# EAGLE design Speed (EAGLE 6.5.0)

## Sheet 1 of 2
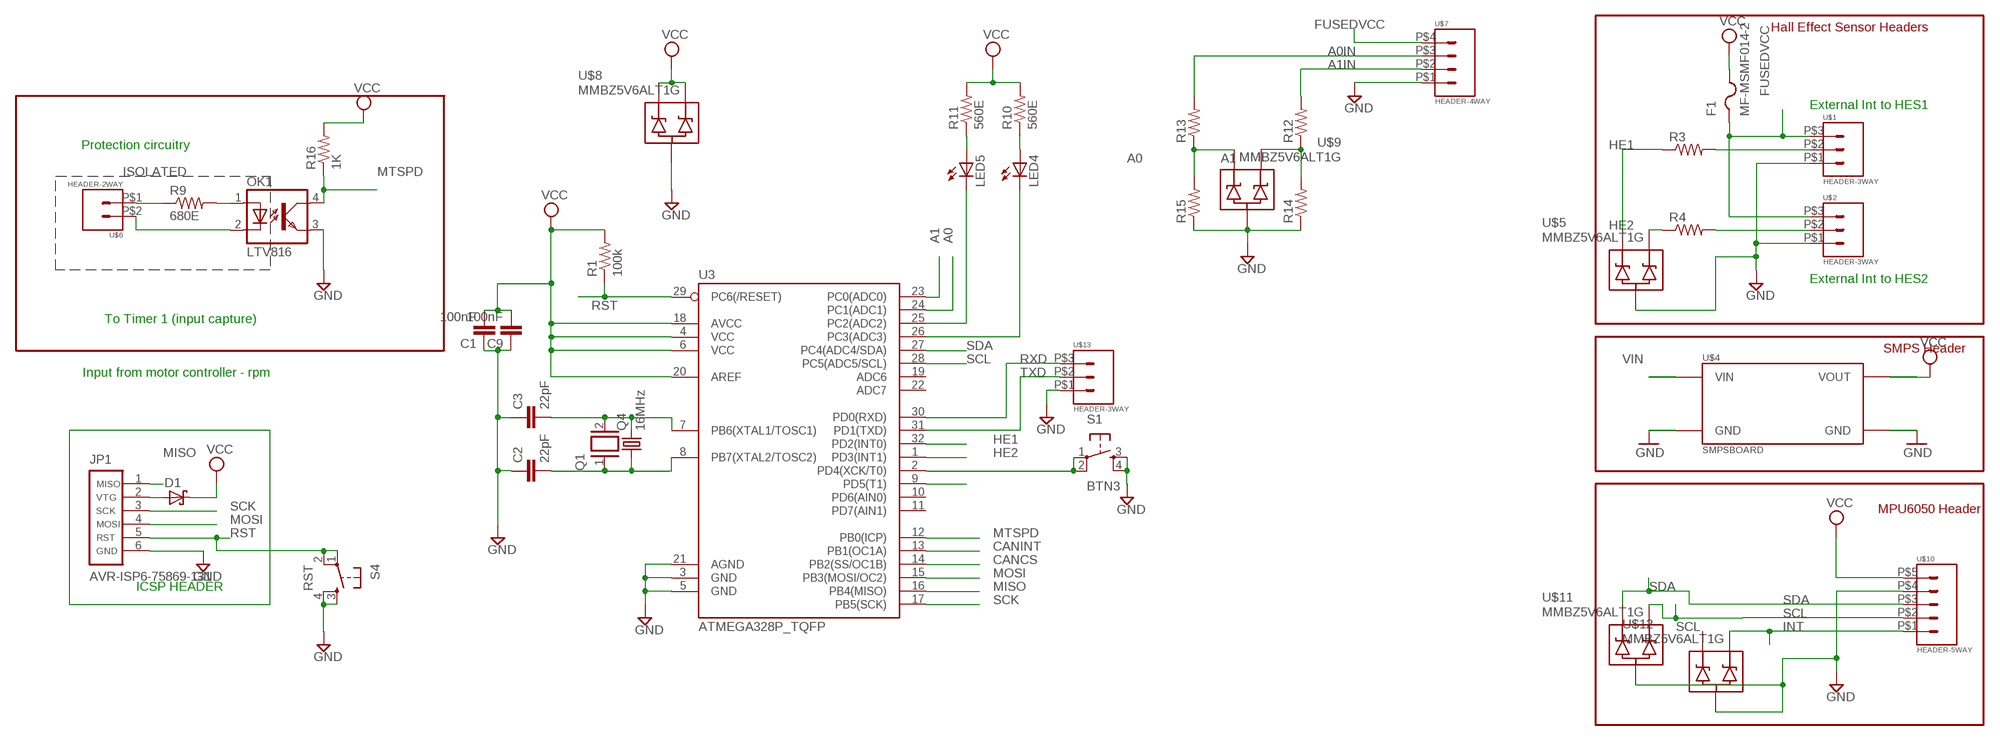
[diagram p0: schematic, sheet 1]

### Parts
C1  100nF  C-EUC0805  [C0805]
C2  22pF  C-EUC0805  [C0805]
C3  22pF  C-EUC0805  [C0805]
C9  100nF  C-EUC0805  [C0805]
D1  SCHOTTKY-DIODESMD  [SMB]
F1  MF-MSMF014-2  PTCFUSE-1812  [1812]
JP1  AVR-ISP6-75869-131  [HDR-75869-131]
LED4  LEDCHIP-LED0805  [CHIP-LED0805]
LED5  LEDCHIP-LED0805  [CHIP-LED0805]
OK1  LTV816  [DIL04]
Q1  XTAL/S  [QS]
Q4  16MHz  CRYSTALHC49UP  [HC49UP]
R1  100k  R-US_M0805  [M0805]
R3  R-US_M0805  [M0805]
R4  R-US_M0805  [M0805]
R9  680E  R-US_M0805  [M0805]
R10  560E  R-US_M0805  [M0805]
R11  560E  R-US_M0805  [M0805]
R12  R-US_M0805  [M0805]
R13  R-US_M0805  [M0805]
R14  R-US_M0805  [M0805]
R15  R-US_M0805  [M0805]
R16  1K  R-US_M0805  [M0805]
S1  BTN3  TAC_SWITCHSMD  [TACTILE_SWITCH_SMD]
S4  RST  TAC_SWITCHSMD  [TACTILE_SWITCH_SMD]
U3  ATMEGA328P_TQFP  [TQFP32-08]
U$1  HEADER-3WAY  [1744426-3]
U$2  HEADER-3WAY  [1744426-3]
U$4  SMPSBOARD  [SMPSBOARD]
U$5  MMBZ5V6ALT1G  [SOT23]
U$6  HEADER-2WAY  [1744426-2]
U$7  HEADER-4WAY  [1744426-4]
U$8  MMBZ5V6ALT1G  [SOT23]
U$9  MMBZ5V6ALT1G  [SOT23]
U$10  HEADER-5WAY  [1744426-5]
U$11  MMBZ5V6ALT1G  [SOT23]
U$12  MMBZ5V6ALT1G  [SOT23]
U$13  HEADER-3WAY  [1744426-3]

### Nets
A0: R12.1 R14.2 U3.24(PC1(ADC1)) U$9.2(A2)
A0IN: R13.2 U$7.P$3
A1: R13.1 R15.2 U3.23(PC0(ADC0)) U$9.1(A1)
A1IN: R12.2 U$7.P$2
CANCS: U3.14(PB2(SS/OC1B)) ; also sheet 2
CANINT: U3.13(PB1(OC1A)) ; also sheet 2
FUSEDVCC: F1.1 U$1.P$3 U$2.P$3 U$7.P$4
GND: C1.1 C2.1 C3.1 C9.1 JP1.6 OK1.3(EMIT) R14.1 R15.1 S1.3 S1.4 S4.3 S4.4 U3.3(GND) U3.5(GND) U3.21(AGND) U$1.P$1 U$2.P$1 U$4.GND U$4.GND@(GND) U$5.3(C) U$7.P$1 U$8.3(C) U$9.3(C) U$10.P$4 U$11.3(C) U$12.3(C) U$13.P$1 ; also sheet 2
HE1: R3.1 U3.32(PD2(INT0)) U$5.2(A2)
HE2: R4.1 U3.1(PD3(INT1)) U$5.1(A1)
INT: U3.9(PD5(T1)) U$10.P$1 U$12.1(A1)
MISO: JP1.1 U3.16(PB4(MISO)) ; also sheet 2
MOSI: JP1.4 U3.15(PB3(MOSI/OC2)) ; also sheet 2
MTSPD: OK1.4(COL) R16.1 U3.12(PB0(ICP))
N$2: D1.A JP1.2
N$3: R9.1 U$6.P$1
N$4: OK1.1(A) R9.2
N$5: C3.2 Q1.2 Q4.2 U3.7(PB6(XTAL1/TOSC1))
N$6: C2.2 Q1.1 Q4.1 U3.8(PB7(XTAL2/TOSC2))
N$7: LED4.A R10.1
N$8: LED5.A R11.1
N$9: LED5.C U3.25(PC2(ADC2))
N$10: LED4.C U3.26(PC3(ADC3))
N$11: S1.1 S1.2 U3.2(PD4(XCK/T0))
N$12: OK1.2(C) U$6.P$2
PD2: R3.2 U$1.P$2
PD3: R4.2 U$2.P$2
RST: JP1.5 R1.1 S4.1 S4.2 U3.29(PC6(/RESET))
RXD: U3.30(PD0(RXD)) U$13.P$3
SCK: JP1.3 U3.17(PB5(SCK)) ; also sheet 2
SCL: U3.28(PC5(ADC5/SCL)) U$10.P$2 U$11.1(A1)
SDA: U3.27(PC4(ADC4/SDA)) U$10.P$3 U$11.2(A2)
TXD: U3.31(PD1(TXD)) U$13.P$2
VCC: C1.2 C9.2 D1.C F1.2 R1.2 R10.2 R11.2 R16.2 U3.4(VCC) U3.6(VCC) U3.18(AVCC) U3.20(AREF) U$4.VOUT U$8.1(A1) U$8.2(A2) U$10.P$5 ; also sheet 2
VIN: U$4.VIN ; also sheet 2
Unconnected: U3.10(PD6(AIN0)) U3.11(PD7(AIN1)) U3.19(ADC6) U3.22(ADC7) U$12.2(A2)

### Notes on the sheet
- Hall Effect Sensor Headers
- External Int to HES1
- Protection circuitry
- ISOLATED
- External Int to HES2
- To Timer 1 (input capture)
- SMPS Header
- Input from motor controller - rpm
- MPU6050 Header
- ICSP HEADER

## Sheet 2 of 2
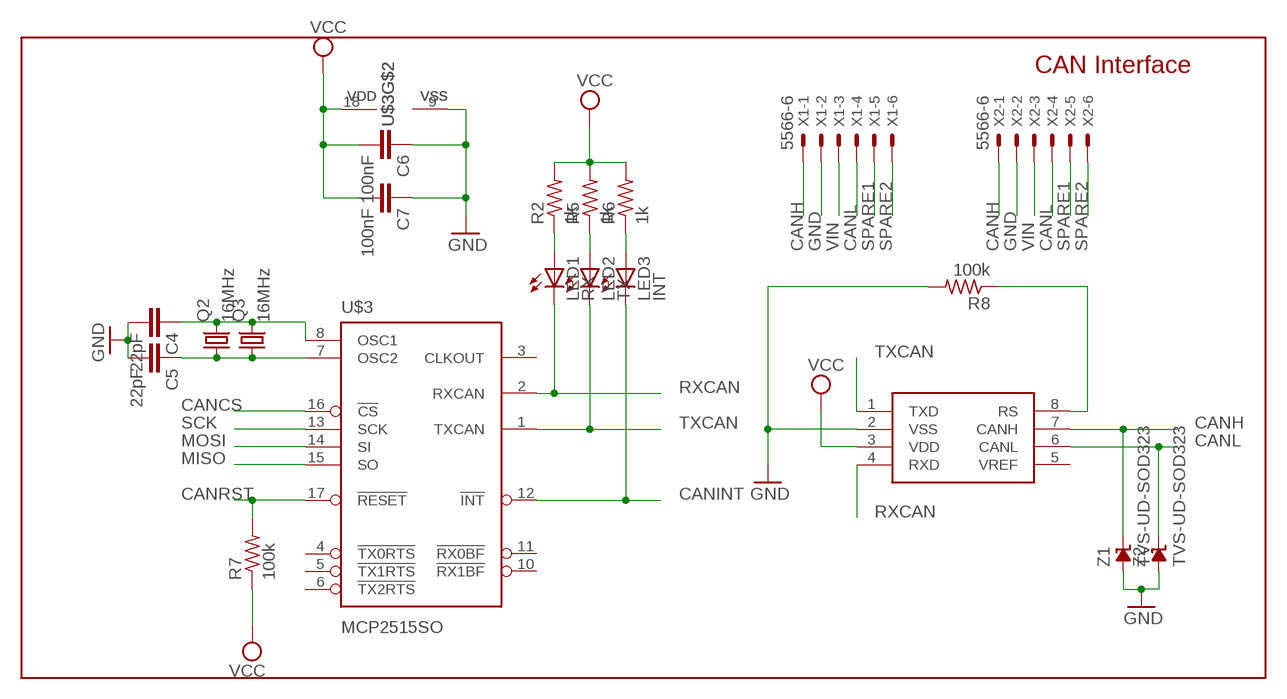
[diagram p1: schematic, sheet 2]

### Parts
C4  22pF  C-EUC0805K  [C0805K]
C5  22pF  C-EUC0805K  [C0805K]
C6  100nF  C-EUC0805K  [C0805K]
C7  100nF  C-EUC0805K  [C0805K]
LED1  RX  LEDCHIP-LED0805  [CHIP-LED0805]
LED2  TX  LEDCHIP-LED0805  [CHIP-LED0805]
LED3  INT  LEDCHIP-LED0805  [CHIP-LED0805]
Q2  16MHz  CRYSTALHC49S  [HC49/S]
Q3  16MHz  CRYSTALHC49UP  [HC49UP]
R2  1k  R-US_R0805  [R0805]
R5  1k  R-US_R0805  [R0805]
R6  1k  R-US_R0805  [R0805]
R7  100k  R-US_R0805  [R0805]
R8  100k  R-US_R0805  [R0805]
U2  MCP2551  [SO08]
U$3  MCP2515SO  [SO-18W]
X1  5566-6  [5566-6]
X2  5566-6  [5566-6]
Z1  TVS-UD-SOD323  [SOD323]
Z2  TVS-UD-SOD323  [SOD323]

### Nets
CANCS: U$3.16(!CS) ; also sheet 1
CANH: U2.7(CANH) X1.1 X2.1 Z1.C
CANINT: LED3.C U$3.12(!INT) ; also sheet 1
CANL: U2.6(CANL) X1.4 X2.4 Z2.C
CANRST: R7.2 U$3.17(!RESET)
CANSTBY: R8.1 U2.8(RS)
GND: C4.2 C5.2 C6.1 C7.1 R8.2 U2.2(VSS) U$3.9(VSS) X1.2 X2.2 Z1.A Z2.A ; also sheet 1
MISO: U$3.15(SO) ; also sheet 1
MOSI: U$3.14(SI) ; also sheet 1
N$15: LED1.A R2.1
N$16: LED2.A R5.1
N$17: LED3.A R6.1
N$18: C4.1 Q2.2 Q3.2 U$3.8(OSC1)
N$19: C5.1 Q2.1 Q3.1 U$3.7(OSC2)
RXCAN: LED1.C U2.4(RXD) U$3.2(RXCAN)
SCK: U$3.13(SCK) ; also sheet 1
SPARE1: X1.5 X2.5
SPARE2: X1.6 X2.6
TXCAN: LED2.C U2.1(TXD) U$3.1(TXCAN)
VCC: C6.2 C7.2 R2.2 R5.2 R6.2 R7.1 U2.3(VDD) U$3.18(VDD) ; also sheet 1
VIN: X1.3 X2.3 ; also sheet 1
Unconnected: U2.5(VREF) U$3.3(CLKOUT) U$3.4(!TX0RTS) U$3.5(!TX1RTS) U$3.6(!TX2RTS) U$3.10(!RX1BF) U$3.11(!RX0BF)

### Notes on the sheet
- CAN Interface

## Library data of the parts
C1-C7 C9 = resistor:C-EU: CAPACITOR, European symbol
D1 = diode:SCHOTTKY-DIODE: Schottky Diode
F1 = adafruit:PTCFUSE: PTC fuses, resettable thermistors
JP1 = atmel-avr:AVR-ISP6-: AVR ISP-6 Serial Programming Header
LED1-LED5 = led:LED: LED OSRAM: - CHIPLED LG R971, LG N971, LY N971, LG Q971, LY Q971, LO R971, LY R971 LH N974, LH R974 LS Q976, LO Q976, LY Q976 LO Q996 - Hyper CHIPLED LW Q18S LB Q993, LB Q99A, LB R99A - SideLED LS A670, LO A670, LY A670, LG A670, LP A670 LB A673, LV A673, LT A673, LW A673 LH A674 LY A675 LS A676, LA A676, LO A676, LY A676, LW A676 LS A679, LY A679, LG A679 - Hyper Micro SIDELED® LS Y876, LA Y876, LO Y876, LY Y876 LT Y87S - SmartLED LW L88C, LW L88S LB L89C, LB L89S, LG L890 LS L89K, LO L89K, LY L89K LS L896, LA L896, LO L896, LY L896 - TOPLED LS T670, LO T670, LY T670, LG T670, LP T670 LSG T670, LSP T670, LSY T670, LOP T670, LYG T670 LG T671, LOG T671, LSG T671 LB T673, LV T673, LT T673, LW T673 LH T674 LS T676, LA T676, LO T676, LY T676, LB T676, LH T676, LSB T676, LW T676 LB T67C, LV T67C, LT T67C, LS T67K, LO T67K, LY T67K, LW E67C LS E67B, LA E67B, LO E67B, LY E67B, LB E67C, LV E67C, LT E67C LW T67C LS T679, LY T679, LG T679 LS T770, LO T770, LY T770, LG T770, LP T770 LB T773, LV T773, LT T773, LW T773 LH T774 LS E675, LA E675, LY E675, LS T675 LS T776, LA T776, LO T776, LY T776, LB T776 LHGB T686 LT T68C, LB T68C - Hyper Mini TOPLED® LB M676 - Mini TOPLED Santana® LG M470 LS M47K, LO M47K, LY M47K Source: http://www.osram.convergy.de LUXEON: - LUMILED® LXK2-PW12-R00, LXK2-PW12-S00, LXK2-PW14-U00, LXK2-PW14-V00 LXK2-PM12-R00, LXK2-PM12-S00, LXK2-PM14-U00 LXK2-PE12-Q00, LXK2-PE12-R00, LXK2-PE12-S00, LXK2-PE14-T00, LXK2-PE14-U00 LXK2-PB12-K00, LXK2-PB12-L00, LXK2-PB12-M00, LXK2-PB14-N00, LXK2-PB14-P00, LXK2-PB14-Q00 LXK2-PR12-L00, LXK2-PR12-M00, LXK2-PR14-Q00, LXK2-PR14-R00 LXK2-PD12-Q00, LXK2-PD12-R00, LXK2-PD12-S00 LXK2-PH12-R00, LXK2-PH12-S00 LXK2-PL12-P00, LXK2-PL12-Q00, LXK2-PL12-R00 Source: www.luxeon.com KINGBRIGHT: KA-3528ASYC Source: www.kingbright.com
OK1 = optocoupler:LTV816: OPTO COUPLER Source: LITEON, LTV816.pdf; OC_FARNELL: unknown; OC_NEWARK: unknown
Q1 = special:XTAL/S: CRYSTAL
Q2 = crystal:CRYSTAL: CRYSTAL; OC_FARNELL: 1667008; OC_NEWARK: unknown
Q3 Q4 = crystal:CRYSTAL: CRYSTAL; OC_FARNELL: unknown; OC_NEWARK: unknown
R1-R16 = resistor:R-US_: RESISTOR, American symbol
S1 S4 = SparkFun:TAC_SWITCH: Momentary Switch Button commonly used for reset or general input. Spark Fun Electronics SKU : COM-00097
U2 = SparkFun:MCP2551
U3 = SparkFun-DigitalIC:ATMEGA328P_TQFP; PROD_ID: IC-09069
U$1 U$2 U$13 = con-TE-EP:HEADER-3WAY
U$3 = RobThePyro:MCP2515: MCP2515 CAN Controller by Microchip
U$4 = RobThePyro:SMPSBOARD
U$5 U$8 U$9 U$11 U$12 = RobThePyro:MMBZ5V6ALT1G
U$6 = con-TE-EP:HEADER-2WAY
U$7 = con-TE-EP:HEADER-4WAY
U$10 = con-TE-EP:HEADER-5WAY
X1 X2 = con-molex:5566-6: Mini FIT connector 6 pol Source: http://www.molex.com; MPN: 95566-61002; OC_FARNELL: unknown; OC_NEWARK: 22K8620
Z1 Z2 = supressor:TVS-UD-: TVS UNI-DIRECTIONAL

## Board
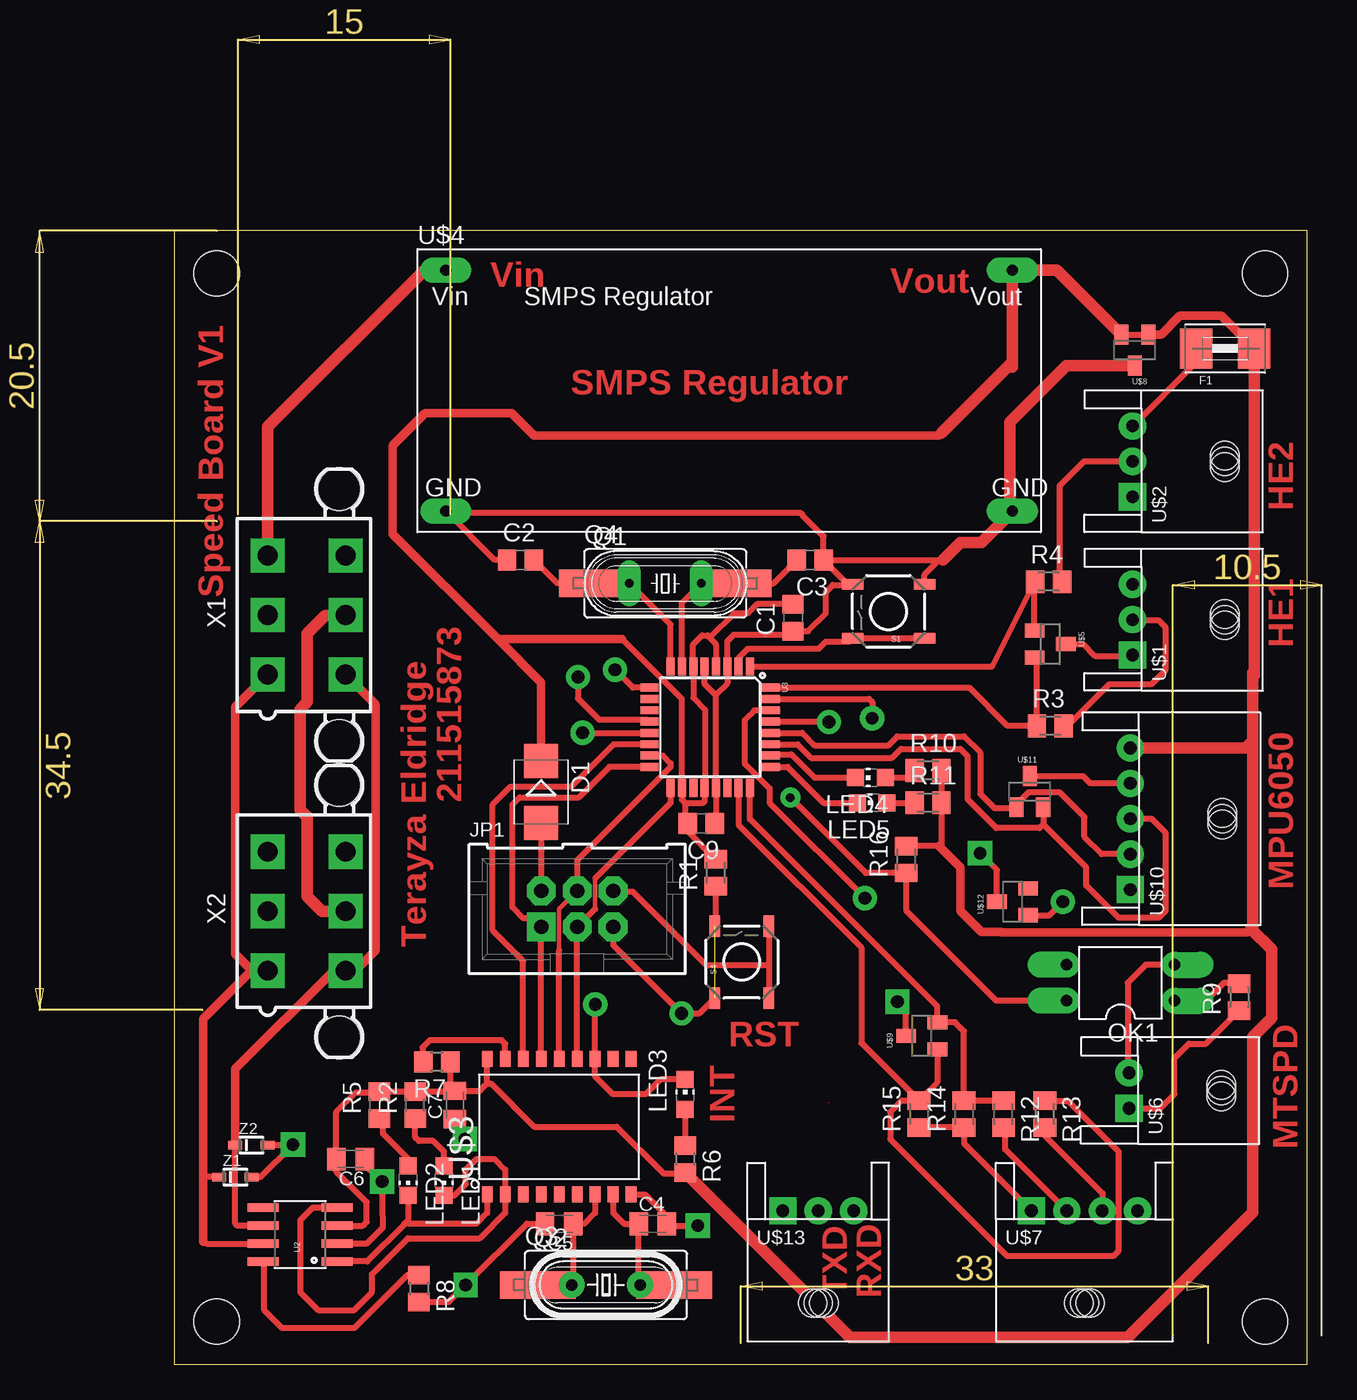
[diagram p2: board, top side]
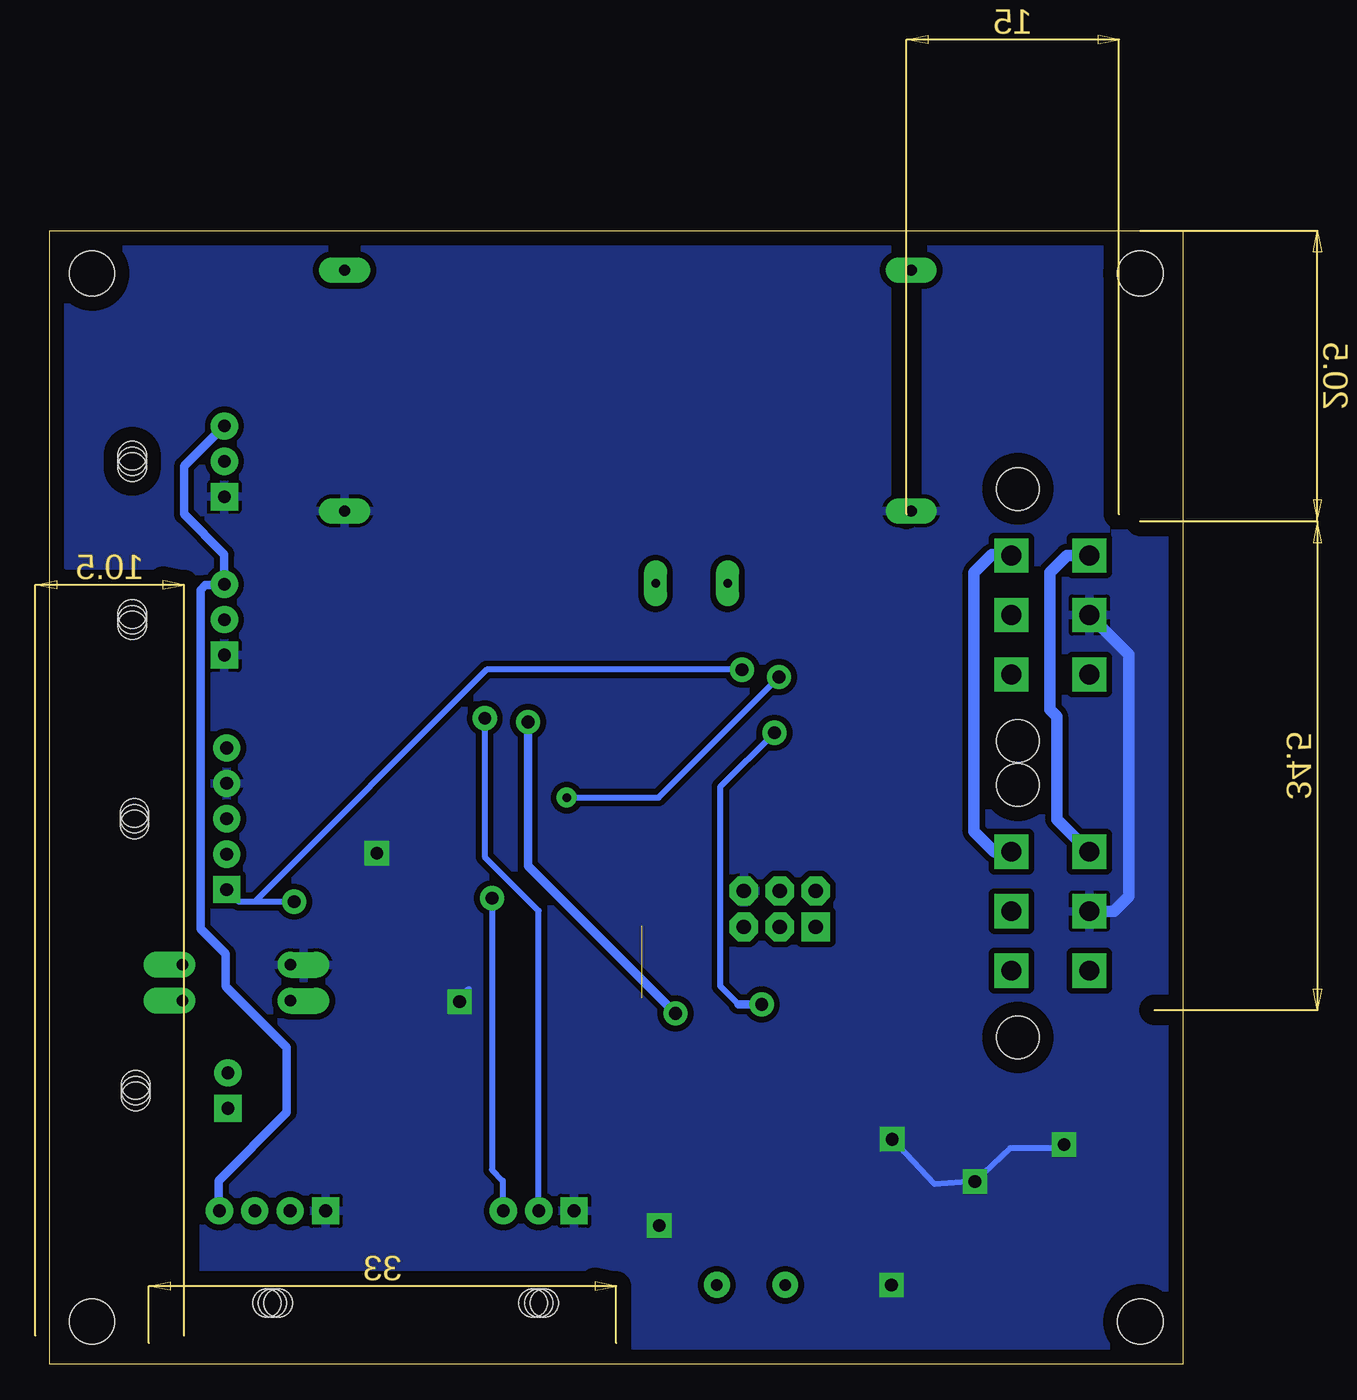
[diagram p3: board, bottom side, seen from below]

Size 80 x 80 mm. Coordinates in mm from the lower left corner, seen from the top.
Outline: 0,0 80,0 80,80 0,80 0,0
Copper layers (1*16): Top 0.035mm / dielectric 1.5mm / Bottom 0.035mm
Design rules "default *": minimum track width 16mil, minimum drill 24mil, track to track 8mil, track to pad 8mil, pad to pad 8mil, via to via 8mil, smd to smd 8mil, copper to edge 40mil, drill to drill 8mil, minimum pad ring 20mil, minimum via ring 16mil, stop-mask expansion 4mil, vias tented up to drill 0mil, thermal gap 10mil
Holes 3.2 mm at 3,77 77,77 77,3 3,3

### Footprints (pad centres in the part's own frame; a part is rotated, then mirrored left to right if it is on the bottom)
C0805 = smd 1.3 x 1.5: 1 -0.95,0; 2 0.95,0
C0805K = smd 1.3 x 1.6: 1 -1,0; 2 1,0
SMB = smd 2.4 x 2.4: A 2.2,0; C -2.2,0
1812 = smd 2.286 x 2.794: 1 -2.046,0; 2 2.046,0
HDR-75869-131 = drill 1.016 pad 1.676 square: 1 -2.54,-1.27 | drill 1.016 pad 1.676 octagon: 2 -2.54,1.27; 3 0,-1.27; 4 0,1.27; 5 2.54,-1.27; 6 2.54,1.27
CHIP-LED0805 = smd 1.2 x 1.2: A 0,-1.05; C 0,1.05
DIL04 = drill 0.813 offset: 1 -1.27,-3.81; 2 1.27,-3.81; 3 1.27,3.81; 4 -1.27,3.81
QS = drill 0.61 long: 1 -2.54,0; 2 2.54,0
HC49/S = drill 0.813: 1 -2.413,0; 2 2.413,0
HC49UP = smd 5.334 x 1.93: 1 -4.826,0; 2 4.826,0
M0805 = smd 1.3 x 1.6: 1 -0.95,0; 2 0.95,0
R0805 = smd 1.3 x 1.5: 1 -0.95,0; 2 0.95,0
TACTILE_SWITCH_SMD = smd 1.524 x 0.762: 1 -2.54,1.905; 2 2.54,1.905; 3 -2.54,-1.905; 4 2.54,-1.905
SO08 = smd 0.61 x 2.21: 1 -1.905,-2.616; 2 -0.635,-2.616; 3 0.635,-2.616; 4 1.905,-2.616; 5 1.905,2.616; 6 0.635,2.616; 7 -0.635,2.616; 8 -1.905,2.616
TQFP32-08 = smd 1.27 x 0.559: 1 -4.293,2.8; 2 -4.293,2; 3 -4.293,1.2; 4 -4.293,0.4; 5 -4.293,-0.4; 6 -4.293,-1.2; 7 -4.293,-2; 8 -4.293,-2.8; 17 4.293,-2.8; 18 4.293,-2; 19 4.293,-1.2; 20 4.293,-0.4; 21 4.293,0.4; 22 4.293,1.2; 23 4.293,2; 24 4.293,2.8 | smd 0.559 x 1.27: 9 -2.8,-4.293; 10 -2,-4.293; 11 -1.2,-4.293; 12 -0.4,-4.293; 13 0.4,-4.293; 14 1.2,-4.293; 15 2,-4.293; 16 2.8,-4.293; 25 2.8,4.293; 26 2,4.293; 27 1.2,4.293; 28 0.4,4.293; 29 -0.4,4.293; 30 -1.2,4.293; 31 -2,4.293; 32 -2.8,4.293
1744426-3 = drill 0.9 square: P$1 -2.5,6.5 | drill 0.9: P$2 0,6.5; P$3 2.5,6.5 | hole 2: 0,0; -0.4,0; 0.4,0
SO-18W = smd 0.762 x 1.143: 1 -5.08,-4.788; 2 -3.81,-4.788; 3 -2.54,-4.788; 4 -1.27,-4.788; 5 0,-4.788; 6 1.27,-4.788; 7 2.54,-4.788; 8 3.81,-4.788; 9 5.08,-4.788; 10 5.08,4.788; 11 3.81,4.788; 12 2.54,4.788; 13 1.27,4.788; 14 0,4.788; 15 -1.27,4.788; 16 -2.54,4.788; 17 -3.81,4.788; 18 -5.08,4.788
SMPSBOARD = drill 0.8 long: GND 2,1.5; GND@ 42,1.5; VIN 2,18.5; VOUT 42,18.5
SOT23 = smd 1 x 1.4: 1 -0.95,-1.1; 2 0.95,-1.1; 3 0,1.1
1744426-2 = drill 0.9 square: P$1 -1.25,6.5 | drill 0.9: P$2 1.25,6.5 | hole 2: 0,0; -0.4,0; 0.4,0
1744426-4 = drill 0.9 square: P$1 -3.75,6.5 | drill 0.9: P$2 -1.25,6.5; P$3 1.25,6.5; P$4 3.75,6.5 | hole 2: 0,0; -0.4,0; 0.4,0
1744426-5 = drill 0.9 square: P$1 -5,6.5 | drill 0.9: P$2 -2.5,6.5; P$3 0,6.5; P$4 2.5,6.5; P$5 5,6.5 | hole 2: 0,0; -0.4,0; 0.4,0
5566-6 = drill 1.4 square: 1 4.2,-2.75; 2 0,-2.75; 3 -4.2,-2.75; 4 4.2,2.75; 5 0,2.75; 6 -4.2,2.75 | hole 3: 8.9,2.29; -8.9,2.29
SOD323 = smd 1 x 0.6: A 1.143,0; C -1.143,0

### Placement (x,y rotation side)
C1  43.69,52.7 90 top
C2  24.45,56.77 0 top
C3  44.89,56.77 180 top
C4  33.78,9.91 0 top
C5  27.18,9.91 180 top
C6  12.45,14.48 180 top
C7  19.81,18.29 90 top
C9  37.21,38.16 180 top
D1  25.91,40.39 270 top
F1  74.2,71.69 0 top
JP1  28.45,32.13 0 top
LED1  19.05,12.95 180 top
LED2  16.51,12.95 180 top
LED3  36.07,19.05 0 top
LED4  49.15,41.4 90 top
LED5  49.28,39.62 90 top
OK1  66.8,26.92 90 top
Q1  34.67,55.12 0 top
Q2  30.48,5.59 0 top
Q3  30.48,5.59 0 top
Q4  34.67,55.12 0 top
R1  38.23,34.69 90 top
R2  17.02,18.29 90 top
R3  61.85,45.05 0 top
R4  61.72,55.23 0 top
R5  14.48,18.29 90 top
R6  36.07,14.48 270 top
R7  18.54,21.34 180 top
R8  17.27,5.33 270 top
R9  75.18,25.91 90 top
R10  53.21,41.91 0 top
R11  53.21,39.62 0 top
R12  58.55,17.65 270 top
R13  61.47,17.65 270 top
R14  55.75,17.65 90 top
R15  52.58,17.65 90 top
R16  51.67,35.62 90 top
S1  50.43,53.14 180 top
S4  40.07,28.38 90 top
U2  8.89,9.14 90 top
U3  37.85,44.96 270 top
U$1  74.16,52.55 90 top
U$2  74.16,63.73 90 top
U$3  27.18,16.76 0 top
U$4  17.18,58.72 0 top
U$5  61.84,50.83 270 top
U$6  73.91,19.3 90 top
U$7  64.26,4.32 0 top
U$8  67.81,71.59 180 top
U$9  52.77,23.18 90 top
U$10  74,38.5 90 top
U$11  60.4,40.41 0 top
U$12  59.18,32.64 90 top
U$13  45.47,4.32 0 top
X1  9.35,52.88 270 top
X2  9.35,31.97 270 top
Z1  4.32,13.21 0 top
Z2  5.45,15.47 0 top

### Tracks (layer width: path | path; a pad name or v marks a point on that pad's centre or on a via)
A0
  Top 0.406: R12.1 R14.2 55.75,23.5 55.12,24.13 U$9.2 53.87,25.25 40.64,38.48 40.64,40.66 U3.24
A0IN
  Top 0.406: U$7.P$3 65.53,10.84 65.53,12.06 61.47,16.13 R13.2
A1
  Top 0.406: R13.1 61.53,18.54 63.12,18.54 66.67,14.99 66.67,8 66.29,7.62 58.8,7.62 50.55,15.88 50.55,17.78 51.37,18.6 R15.2 | U$9.1 53.87,19.89 R15.2 | U3.23 39.85,38.07 48.51,29.4 48.51,22.67 R15.2
A1IN
  Top 0.406: 63.01,11.41 U$7.P$2 58.67,15.16 58.67,16.58 R12.2
CANCS
  Top 0.406: U$3.16 24.64,28.45 22.48,30.61 22.48,39.5 23.75,40.77 28.05,40.77 31.04,43.76 U3.14
CANH
  Top 0.406: 2.03,8.64 2.16,8.64 2.29,8.51 U2.7 | Z1.C 2.16,13.21 2.03,13.08
  Top 0.61: X2.1 5.5,27.77 | 5.5,27.77 4.32,28.96 4.32,46.4 X1.1 | 5.5,27.77 5.42,27.77 2.03,24.38 2.03,13.08 2.03,8.64
CANINT  (via drill 0.9)
  Top 0.406: LED3.C 34.32,20.1 33.27,19.05 30.99,19.05 29.72,20.32 U$3.12 v29.72,25.4 | v28.83,44.57 U3.13
  Bottom 0.406: 31.37,25.4 32.64,26.67 32.64,40.76 v28.83,44.57
  Bottom 0.61: v29.72,25.4 31.37,25.4
CANL
  Top 0.406: U2.6 4.45,9.78 4.32,9.91 Z2.C
  Top 0.61: X1.4 14.22,46.56 14.22,29.21 12.78,27.77 X2.4 11.26,27.77 4.32,20.83 4.32,15.48 Z2.C
CANRST
  Top 0.406: U$3.17 23.37,22.61 23.11,22.86 18.03,22.86 17.53,22.35 17.53,21.4 R7.2
CANSTBY
  Top 0.406: R8.1 16.44,6.28 12.7,2.54 7.62,2.54 6.35,3.81 6.35,7.16 U2.8
FUSEDVCC
  Top 0.406: F1.1 72.15,70.72 U$2.P$3
  Bottom 0.61: U$7.P$4 68.07,10.88 68.07,12.95 63.25,17.78 63.25,22.35 67.56,26.67 67.56,28.96 69.34,30.73 69.34,54.66 69,55 67.71,55 U$1.P$3 67.66,57.16 70.5,60 70.5,63.39 U$2.P$3
GND  (via drill 0.9, 0.9 pad 1.42)
  Top 0.406: C6.1 13.08,14.11 13.32,14.11 v14.67,12.89 14.73,9.65 13.59,8.51 U2.2 | U$3.9 33.24,11.98 34.54,10.67 34.54,10.14 C4.2 | C7.1 19.81,16.51 v20.51,15.88 | C5.2 24.89,9.91 v20.57,5.59 19.37,4.38 R8.2 17.71,4.38 | C4.2 35.37,9.78 v36.96,9.78 | Z1.A 6.1,13.21 v8.38,15.49 7.85,15.47 Z2.A | 38.23,47.24 38.23,40.68 U3.21 38.25,38.25 C9.1 | 38.99,49.31 U3.3 | R15.1 R14.1 55.75,15.58 U$7.P$1 | 35.1,9.59 C4.2 | 38.23,47.24 37.45,48.02 U3.5 | U3.3 39.05,48.06 38.23,47.24 | C2.1 22.63,56.77 U$4.GND 19.33,60.07 44.26,60.07 44.39,59.94 44.39,59.88 45.84,58.42 C3.1 | U3.3 39.05,51.05 39.5,51.5 43.44,51.5 C1.1 44.75,51.75 46,53 46,54.5 46.5,55 47.84,55 S1.4 47.57,55.05 C3.1 | U$9.3 51.67,24.98 v51.05,25.59 | S4.4 41.97,28.13 | 41.97,28.13 S4.3 | 41.97,28.13 37.59,28.13 32.38,33.34 31.05,33.34 JP1.6 | C3.1 54,56.77 | 54,56.77 54.27,56.77 | S1.3 52.97,55.74 54,56.77 | U$5.3 64.17,50.83 65,50 67.61,50 U$1.P$1 | U$11.3 64.15,41.51 64.64,41.02 67.48,41.02 U$10.P$4 | U$12.3 58.08,34.88 v56.9,36.07
  Top 0.61: 59,60.4 U$4.GND@
  Top 0.813: 54.27,56.77 55.5,58 57,58 59,60 | U$8.3 62.99,70.49 59,66.5 59,60.4
  Bottom 0.406: v8.38,15.49 8.38,14.99 8.64,15.24 12.19,15.24 v14.67,12.89 17.53,12.7 v20.51,15.88 | v51.05,25.59 51.05,25.84 50.42,26.48 | v56.9,36.07 56.9,36.2
  Bottom 0.813: X2.2 4.86,31.97 3.81,33.02 3.81,50.09 X1.2
  pour Bottom (isolate 0.406): 0,0 80,0 80,80 0,80
HE1
  Top 0.406: U3.32 56.13,47.76 58.83,45.05 R3.1 60.9,49.72 U$5.2
HE2
  Top 0.406: U3.1 57.75,49.25 R4.1 60.74,55.2 U$5.1
INT  (via drill 0.9)
  Top 0.406: U$12.1 61.79,31.69 v62.74,32.64 | U3.9 32.38,47.76 v31.11,49.02
  Bottom 0.406: v62.74,32.64 65.53,32.64 | 65.53,32.64 66.64,32.64 U$10.P$1 | v31.11,49.02 49.15,49.02 65.53,32.64
MISO
  Top 0.406: U$3.15 JP1.1 25.27,31.5 24.64,31.5 23.88,32.26 23.88,39.5 24.38,40.01 28.57,40.01 30.73,42.16 U3.16
MOSI
  Top 0.305: 27.18,29.21 27.18,32.13 JP1.4
  Top 0.406: U3.15 34.51,42.96 35.05,42.42 35.05,42.16 28.45,35.56 JP1.4 | U$3.14 27.18,29.21
MTSPD  (via drill 0.6, 0.9)
  Top 0.406: v43.5,40 48.83,34.67 R16.1 51.67,32.03 58.04,25.65 OK1.4 | v28.5,48.5 28.5,47 30,45.5 33.41,45.5 U3.12
  Bottom 0.406: v43.5,40 37,40 v28.5,48.5
N$2
  Top 0.406: D1.A JP1.2
N$3
  Top 0.406: U$6.P$1 69.62,18.05 70.61,19.05 70.61,21.59 71.63,22.61 72.83,22.61 R9.1
N$4
  Top 0.305: 71.88,25.65 72.83,25.65 | 75.12,26.92 R9.2
  Top 0.406: OK1.1 71.88,25.65 | 75.12,26.92 74.11,26.92 72.83,25.65
N$5
  Top 0.406: U3.7 35.85,53.75 Q1.2 Q4.2 42.29,55.12 44.32,57.15 C3.2
N$6
  Top 0.406: U3.8 35.05,52.2 Q1.1 Q4.1 27.05,55.12 C2.2
N$7
  Top 0.406: LED4.A 51.76,41.4 R10.1
N$8
  Top 0.406: LED5.A R11.1
N$9
  Top 0.406: U3.25 43.31,42.16 45.85,39.62 LED5.C
N$10
  Top 0.406: U3.26 42.23,43.05 43.56,43.05 45.21,41.4 LED4.C
N$11
  Top 0.406: U3.2 39.85,49.85 40.5,50.5 45.5,50.5 46,51 47.65,51 S1.2 S1.1
N$12
  Top 0.406: OK1.2 68.58,28.19 67.31,26.92 67.31,20.66 U$6.P$2
N$15
  Top 0.406: LED1.A 19.05,14.99 18.29,15.75 17.27,15.75 17.02,16 R2.1
N$16
  Top 0.406: LED2.A 16.51,14.48 14.73,16.26 14.73,17.08 R5.1
N$17
  Top 0.406: LED3.A R6.1
N$18
  Top 0.406: Q3.2 Q2.2 32.78,5.59 C4.1 31.75,9.91 30.99,10.67 U$3.8
N$19
  Top 0.406: Q3.1 Q2.1 28.18,5.59 C5.1 28.96,9.91 29.72,10.67 U$3.7
PD2
  Top 0.406: R3.2 63.05,45.05 66,48 69,48 70,49 70,52 69.5,52.5 67.71,52.5 U$1.P$2
PD3
  Top 0.406: U$2.P$2 64.23,63.73 62.5,62 62.5,55.4 R4.2
RST  (via drill 0.9)  (1 unrouted)
  Top 0.406: R1.1 38.23,30.99 S4.2 | JP1.5 30.99,29.59 v35.81,24.77 37.08,24.77 S4.1 | U3.29 46.19,45.36 v46.23,45.32
  Bottom 0.61: v35.81,24.77 46.23,35.18 v46.23,45.32
RXCAN
  Top 0.406: LED1.C 19.78,11.9 20.57,12.7 20.57,13.72 21.34,14.48 22.61,14.48 23.37,13.72 U$3.2 23.37,10.67 21.59,8.89 16.51,8.89 13.97,6.35 13.97,5.08 12.7,3.81 10.16,3.81 8.89,5.08 8.89,10.16 9.78,11.05 U2.4
RXD  (via drill 0.9)
  Top 0.406: U3.30 40.95,46.16 40.26,45.47 40.26,42.42 42.04,40.64 42.04,39.62 v48.77,32.89
  Bottom 0.406: v48.77,32.89 48.77,13.72 48.01,12.95 48.01,10.86 U$13.P$3
SCK
  Top 0.305: 29.72,32.13 29.72,34.29
  Top 0.406: U$3.13 JP1.3 29.72,32.13 | U3.17 35.05,39.62 29.97,34.54 29.72,34.29
SCL
  Top 0.406: U$10.P$2 65.47,36 64.26,37.21 64.26,38.61 62.48,40.39 60.33,40.39 59.45,39.51 U$11.1 59.38,39.24 57.91,39.24 56.9,40.26 56.9,43.18 55.75,44.32 51.05,44.32 50.42,43.69 45.21,43.69 44.34,44.56 U3.28
SDA
  Top 0.406: U$10.P$3 69,38.5 70,37.5 70,32 69.5,31.5 66.67,31.5 64.39,33.78 64.39,35.06 61.35,38.11 | U$11.2 61.35,38.11 | 61.35,38.11 61.09,37.85 58.04,37.85 56,39.88 56.01,39.89 56.01,42.93 55.5,43.43 51.31,43.43 50.67,42.8 44.96,42.8 44,43.76 U3.27
SPARE1
  Top 0.813: X2.5 10.45,31.97 9.4,33.02 9.4,38.61 8.89,39.12 8.89,46.23 9.4,46.74 9.4,51.56 10.67,52.83 12.05,52.83 X1.5
SPARE2
  Bottom 0.813: X2.6 13.31,36.17 14.73,37.59 14.73,55.88 13.46,57.15 12.17,57.15 X1.6
TXCAN
  Top 0.406: U$3.1 22.1,10.67 21.34,9.91 16.26,9.91 | LED2.C 16.51,10.16 16.26,9.91 | 16.26,9.91 16.26,9.87 13.63,7.24 U2.1
TXD  (via drill 0.9)
  Top 0.406: U3.31 49.05,46.96 49.28,46.74 v49.28,45.59
  Bottom 0.406: U$13.P$2 45.47,32 49.28,35.81 v49.28,45.59
VCC
  Top 0.406: 38.23,49.23 U3.4 38.25,50.78 38.23,50.8 38.23,50.86 37.8,51.3 | 36.07,39.62 35.85,39.85 U3.18 35.85,46.96 31.62,51.18 | 36.07,39.62 37.34,39.62 37.47,39.75 37.47,40.65 U3.20 37.47,40.68 37.47,46.23 36.65,47.05 U3.6 36.64,50.8 37.27,51.44 37.66,51.44 37.8,51.3 | R10.2 R11.2 54.16,36.58 54,36.58 R16.2 | U2.3 13.34,9.78 13.59,10.03 13.59,11.43 11.43,13.59 11.43,14.46 C6.2 11.45,17.8 12.83,19.18 14.42,19.18 R5.2 R2.2 19.76,19.24 C7.2 | C7.2 21.57,19.29 22.1,19.81 | 22.1,19.81 U$3.18 | R7.1 19.49,19.61 C7.2 | 22.1,19.81 22.35,19.81 25.4,16.76 31.24,16.76 34.54,13.46 36,13.46 R6.2 | U$8.2 U$8.1 | 75.75,30.48 76.01,30.73 76.14,30.86 | 36.07,39.62 36.07,38.36 C9.2 36.26,37.6 R1.2 | C1.2 41.15,53.65 40.5,53 39.5,53 37.8,51.3
  Top 0.61: 75.75,30.48 58.42,30.48 58.4,30.5 57,30.5 55.5,32 55.5,35.08 54,36.58 | D1.C 25.91,48.13 22.86,51.18 | 22.86,51.18 15.43,58.61 15.43,64.83 17.72,67.12 23.81,67.12 25.4,65.53 53.97,65.53 54.17,65.73 | U$8.1 69.69,72.69 71,74 73.93,74 F1.2 | 31.62,51.18 22.86,51.18
  Top 0.813: 59.18,70.74 U$4.VOUT 62.32,77.22 U$8.2 | 59.18,70.74 59.18,70.38 | 54.17,65.73 59.18,70.74 | 76.14,48.83 76.14,48.5 | 76.14,48.5 76.14,44 | 76.14,44 76.14,30.86 | R6.2 47.69,1.91 67.31,1.91 76.14,10.73 76.14,23.11 77.47,24.45 77.47,29.27 76.01,30.73 | F1.2 76.24,48.61 76.14,48.5 | U$10.P$5 75.64,43.5 76.14,44
VIN
  Top 0.813: U$4.VIN 17.66,77.22 6.6,66.17 X1.3
  Bottom 0.813: X1.3 8.2,57.08 9.4,55.88 9.4,46.23 8.89,45.72 8.89,38.46 X2.3
(copper drawn outside any net)
  shapes: Top area x1

### Text on the board
Top: Vin | Vout | Speed Board V1 | SMPS Regulator | HE2 | 211515873 | HE1 | Terayza Eldridge | MPU6050 | RST | INT | MTSPD | TXD | RXD